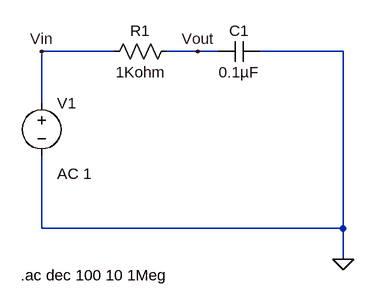
[diagram p0: schematic low pass filter.asc]
low pass filter.asc, the LTspice schematic file:
Version 4.1
SHEET 1 1140 680
WIRE 64 64 -48 64
WIRE 192 64 144 64
WIRE 224 64 192 64
WIRE 416 64 288 64
WIRE -48 144 -48 64
WIRE -48 336 -48 224
WIRE 416 336 416 64
WIRE 416 336 -48 336
WIRE 416 384 416 336
FLAG 416 384 0
FLAG 192 64 Vout
FLAG -48 64 Vin
SYMBOL res 160 48 R90
WINDOW 0 0 56 VBottom 2
WINDOW 3 32 56 VTop 2
SYMATTR InstName R1
SYMATTR Value 1Kohm
SYMBOL cap 288 48 R90
WINDOW 0 0 32 VBottom 2
WINDOW 3 32 32 VTop 2
SYMATTR InstName C1
SYMATTR Value 0.1µF
SYMBOL voltage -48 128 R0
WINDOW 123 24 124 Left 2
WINDOW 39 0 0 Left 0
SYMATTR InstName V1
SYMATTR Value ""
SYMATTR Value2 AC 1
TEXT -80 408 Left 2 !.ac dec 100 10 1Meg

The netlist it stands for:
* low pass filter.asc
R1 Vout Vin 1Kohm
C1 0 Vout 0.1µF
V1 Vin 0 AC 1
.ac dec 100 10 1Meg
.backanno
.end